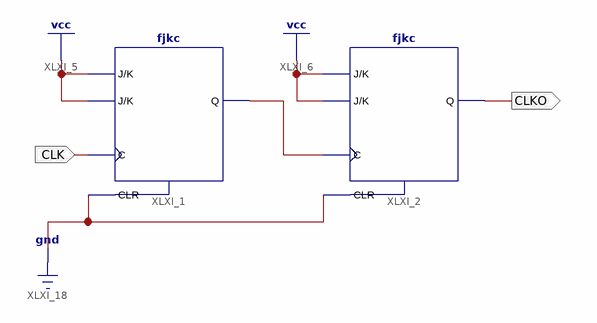
[diagram p0: schematic sheet 1]
// Xilinx ISE schematic clkdiv4.sch (spartan6) as structural Verilog: 2 symbols, 2 ports
module clkdiv4 (
  input  CLK,
  output CLKO
);

  wire XLXN_1;

  fjkc XLXI_1 (.C(CLK), .CLR(1'b0), .J(1'b1), .K(1'b1), .Q(XLXN_1));
  fjkc XLXI_2 (.C(XLXN_1), .CLR(1'b0), .J(1'b1), .K(1'b1), .Q(CLKO));
endmodule
